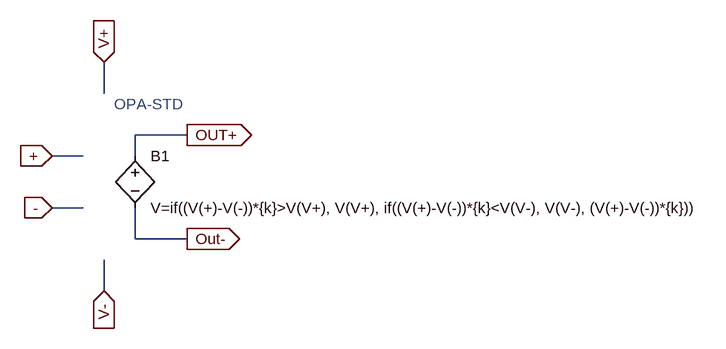
[diagram p0: schematic OPA-STD.asc]
OPA-STD.asc, the LTspice schematic file:
Version 4
SHEET 1 1132 680
WIRE 96 64 96 16
WIRE 224 128 144 128
WIRE 64 160 16 160
WIRE 144 160 144 128
WIRE 64 240 16 240
WIRE 144 288 144 240
WIRE 224 288 144 288
WIRE 96 368 96 320
FLAG 16 160 +
IOPIN 16 160 In
FLAG 224 128 OUT+
IOPIN 224 128 Out
FLAG 16 240 -
IOPIN 16 240 In
FLAG 224 288 Out-
IOPIN 224 288 Out
FLAG 96 16 V+
IOPIN 96 16 In
FLAG 96 368 V-
IOPIN 96 368 In
SYMBOL bv 144 144 R0
SYMATTR InstName B1
SYMATTR Value V=if((V(+)-V(-))*{k}>V(V+), V(V+), if((V(+)-V(-))*{k}<V(V-), V(V-), (V(+)-V(-))*{k}))
TEXT 112 80 Left 0 ;OPA-STD

The netlist it stands for:
* OPA-STD.asc
B1 OUT+ Out- V=if((V(+)-V(-))*{k}>V(V+), V(V+), if((V(+)-V(-))*{k}<V(V-), V(V-), (V(+)-V(-))*{k}))
* OPA-STD
.backanno
.end